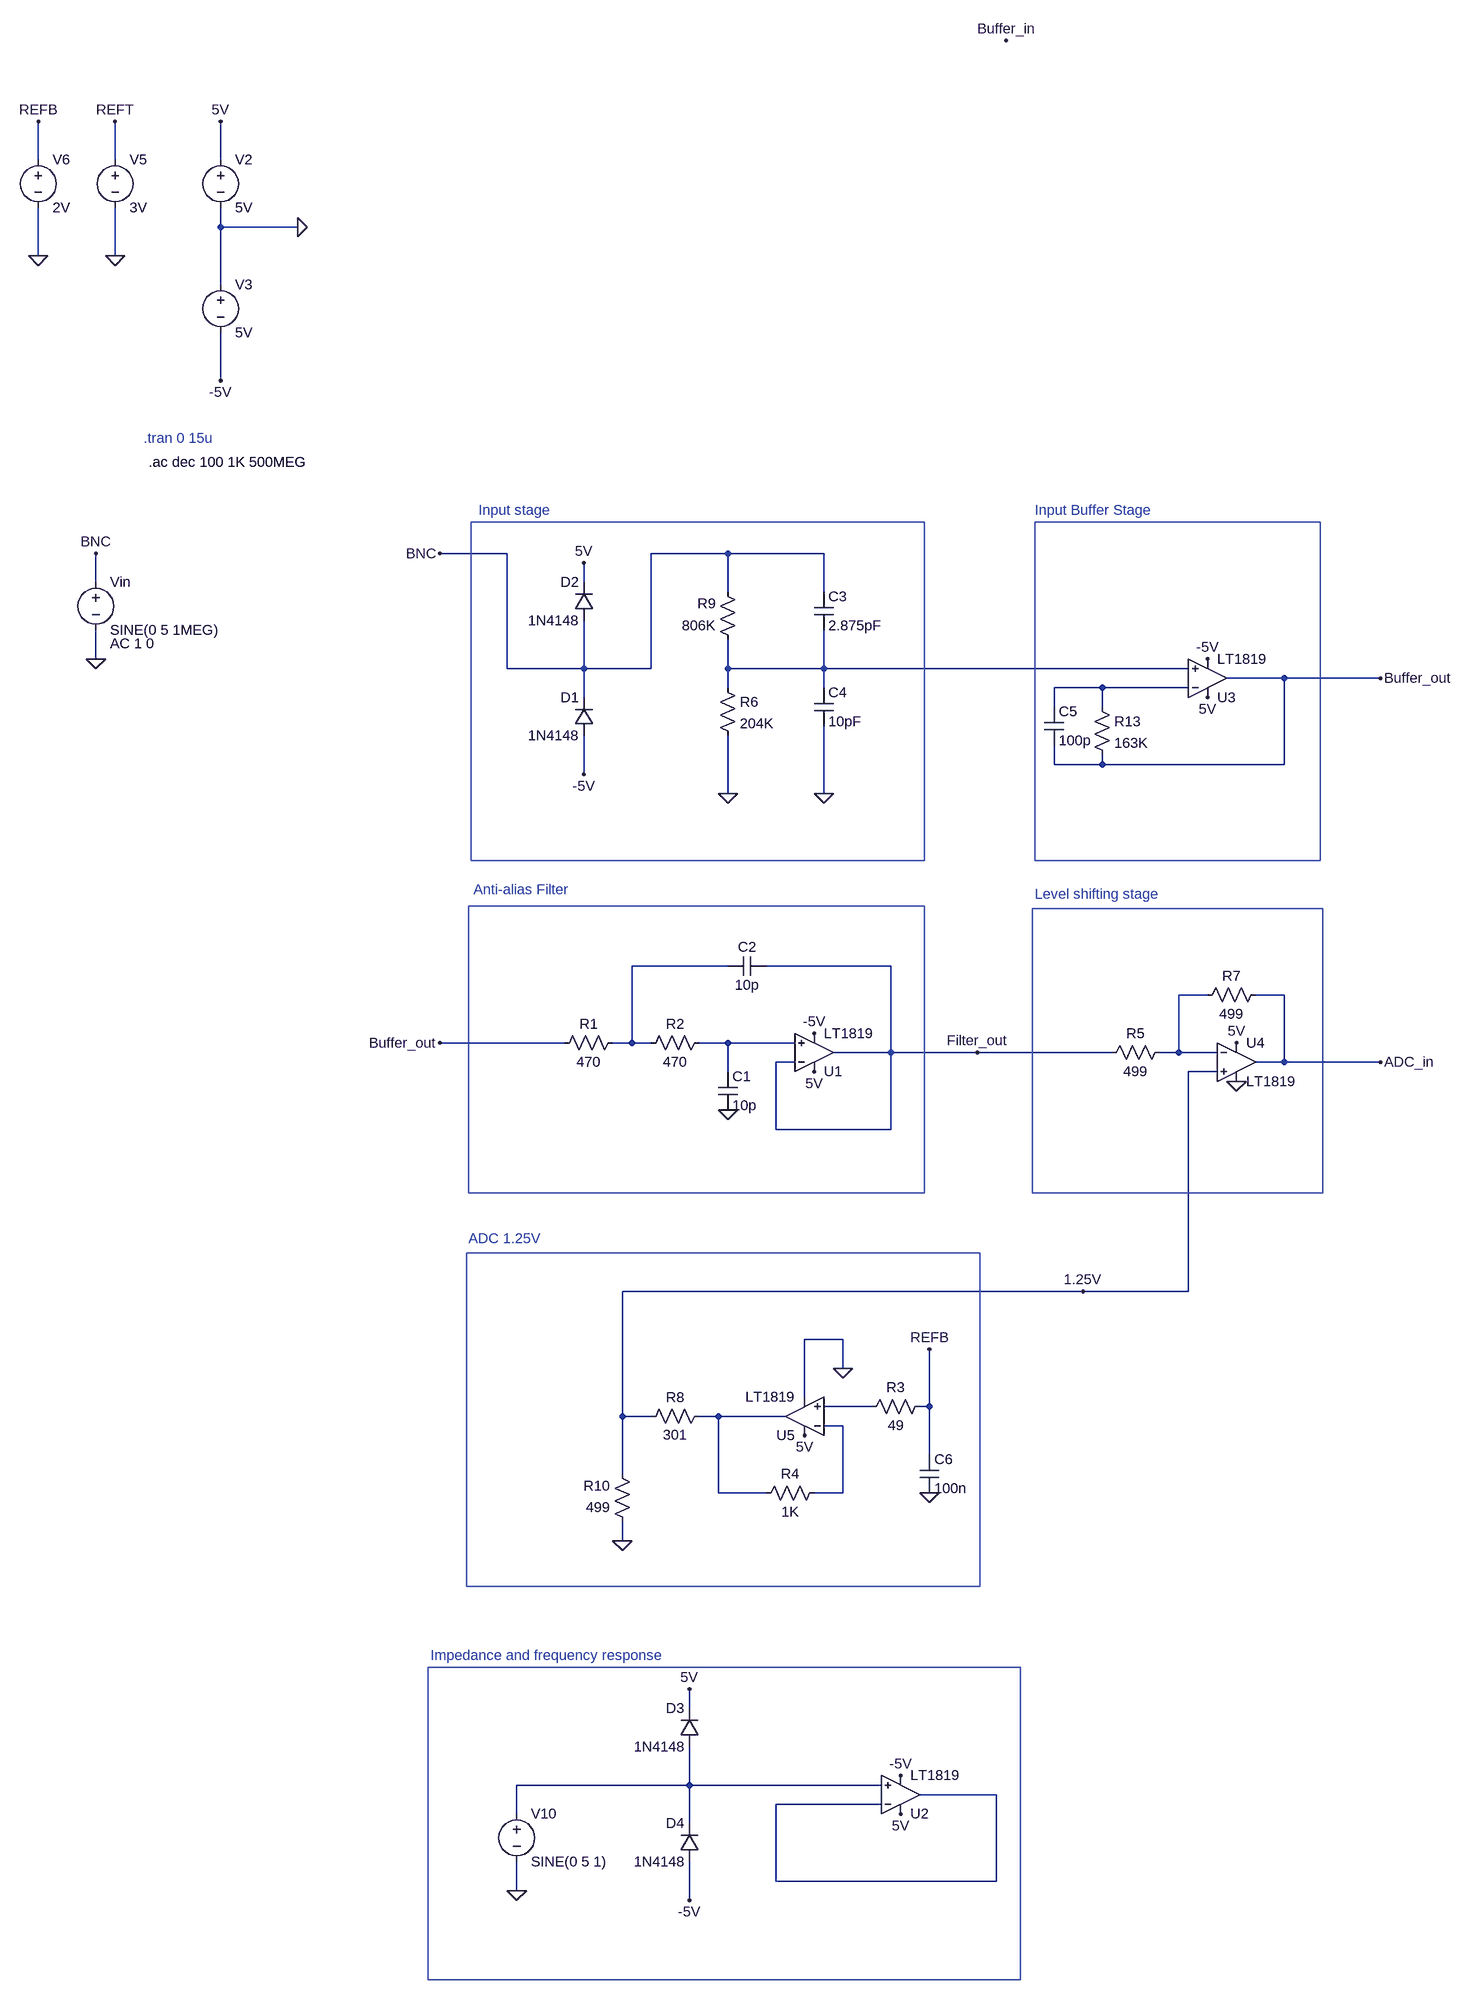
[diagram p0: schematic frontend.asc]
frontend.asc, the LTspice schematic file:
Version 4
SHEET 1 1620 3684
WIRE -2928 -64 -2928 -128
WIRE -2800 -64 -2800 -128
WIRE -2624 -64 -2624 -128
WIRE -2624 48 -2624 16
WIRE -2496 48 -2624 48
WIRE -2928 96 -2928 16
WIRE -2800 96 -2800 16
WIRE -2624 144 -2624 48
WIRE -2624 304 -2624 224
WIRE -2128 592 -2240 592
WIRE -1760 592 -1888 592
WIRE -1600 592 -1760 592
WIRE -2832 640 -2832 592
WIRE -2000 640 -2000 608
WIRE -1760 656 -1760 592
WIRE -1600 656 -1600 592
WIRE -2832 768 -2832 720
WIRE -2128 784 -2128 592
WIRE -2000 784 -2000 704
WIRE -2000 784 -2128 784
WIRE -1888 784 -1888 592
WIRE -1888 784 -2000 784
WIRE -1760 784 -1760 736
WIRE -1600 784 -1600 720
WIRE -1600 784 -1760 784
WIRE -992 784 -1600 784
WIRE -832 800 -928 800
WIRE -672 800 -832 800
WIRE -1760 816 -1760 784
WIRE -1600 816 -1600 784
WIRE -1136 816 -1216 816
WIRE -992 816 -1136 816
WIRE -2000 832 -2000 784
WIRE -1216 848 -1216 816
WIRE -1136 848 -1136 816
WIRE -1216 944 -1216 912
WIRE -1136 944 -1136 928
WIRE -1136 944 -1216 944
WIRE -832 944 -832 800
WIRE -832 944 -1136 944
WIRE -2000 960 -2000 896
WIRE -1760 992 -1760 896
WIRE -1600 992 -1600 880
WIRE -1760 1280 -1920 1280
WIRE -1488 1280 -1696 1280
WIRE -960 1328 -1008 1328
WIRE -832 1328 -880 1328
WIRE -2032 1408 -2240 1408
WIRE -1920 1408 -1920 1280
WIRE -1920 1408 -1952 1408
WIRE -1888 1408 -1920 1408
WIRE -1760 1408 -1808 1408
WIRE -1648 1408 -1760 1408
WIRE -1488 1424 -1488 1280
WIRE -1488 1424 -1584 1424
WIRE -1344 1424 -1488 1424
WIRE -1120 1424 -1344 1424
WIRE -1008 1424 -1008 1328
WIRE -1008 1424 -1040 1424
WIRE -944 1424 -1008 1424
WIRE -1648 1440 -1680 1440
WIRE -832 1440 -832 1328
WIRE -832 1440 -880 1440
WIRE -672 1440 -832 1440
WIRE -1760 1456 -1760 1408
WIRE -944 1456 -992 1456
WIRE -1680 1552 -1680 1440
WIRE -1488 1552 -1488 1424
WIRE -1488 1552 -1680 1552
WIRE -1168 1904 -1936 1904
WIRE -992 1904 -992 1456
WIRE -992 1904 -1168 1904
WIRE -1568 1984 -1632 1984
WIRE -1568 2032 -1568 1984
WIRE -1632 2080 -1632 1984
WIRE -1520 2096 -1600 2096
WIRE -1424 2096 -1424 2000
WIRE -1424 2096 -1440 2096
WIRE -1936 2112 -1936 1904
WIRE -1888 2112 -1936 2112
WIRE -1776 2112 -1808 2112
WIRE -1664 2112 -1776 2112
WIRE -1568 2128 -1600 2128
WIRE -1424 2176 -1424 2096
WIRE -1936 2208 -1936 2112
WIRE -1776 2240 -1776 2112
WIRE -1696 2240 -1776 2240
WIRE -1568 2240 -1568 2128
WIRE -1568 2240 -1616 2240
WIRE -1936 2320 -1936 2288
WIRE -1824 3184 -1824 3152
WIRE -1824 3312 -1824 3248
WIRE -1824 3312 -2112 3312
WIRE -1504 3312 -1824 3312
WIRE -1312 3328 -1440 3328
WIRE -1504 3344 -1680 3344
WIRE -2112 3360 -2112 3312
WIRE -1824 3376 -1824 3312
WIRE -1680 3472 -1680 3344
WIRE -1312 3472 -1312 3328
WIRE -1312 3472 -1680 3472
WIRE -2112 3488 -2112 3440
WIRE -1824 3504 -1824 3440
FLAG -2496 48 0
FLAG -2624 -128 5V
FLAG -2624 304 -5V
FLAG -2800 96 0
FLAG -2928 96 0
FLAG -2928 -128 REFB
FLAG -2800 -128 REFT
FLAG -1616 1392 -5V
FLAG -1616 1456 5V
FLAG -1760 1520 0
FLAG -960 832 5V
FLAG -960 768 -5V
FLAG -1760 992 0
FLAG -1600 992 0
FLAG -2832 768 0
FLAG -2000 608 5V
FLAG -2000 960 -5V
FLAG -912 1408 5V
FLAG -912 1472 0
FLAG -1472 3296 -5V
FLAG -2112 3488 0
FLAG -1472 3360 5V
FLAG -1824 3152 5V
FLAG -1824 3504 -5V
FLAG -1424 2240 0
FLAG -1936 2320 0
FLAG -1632 2144 5V
FLAG -672 800 Buffer_out
FLAG -2240 1408 Buffer_out
FLAG -2832 592 BNC
FLAG -1424 2000 REFB
FLAG -1296 -320 Buffer_in
FLAG -1344 1424 Filter_out
FLAG -1168 1904 1.25V
FLAG -2240 592 BNC
FLAG -672 1440 ADC_in
FLAG -1568 2032 0
SYMBOL voltage -2624 -80 R0
SYMATTR InstName V2
SYMATTR Value 5V
SYMBOL voltage -2624 128 R0
SYMATTR InstName V3
SYMATTR Value 5V
SYMBOL voltage -2800 -80 R0
SYMATTR InstName V5
SYMATTR Value 3V
SYMBOL voltage -2928 -80 R0
SYMATTR InstName V6
SYMATTR Value 2V
SYMBOL res -1936 1392 R90
WINDOW 0 0 56 VBottom 2
WINDOW 3 32 56 VTop 2
SYMATTR InstName R1
SYMATTR Value 470
SYMBOL res -1792 1392 R90
WINDOW 0 0 56 VBottom 2
WINDOW 3 32 56 VTop 2
SYMATTR InstName R2
SYMATTR Value 470
SYMBOL cap -1776 1456 R0
SYMATTR InstName C1
SYMATTR Value 10p
SYMBOL Opamps/LT1819 -1616 1424 M180
SYMATTR InstName U1
SYMBOL cap -1696 1264 R90
WINDOW 0 0 32 VBottom 2
WINDOW 3 32 32 VTop 2
SYMATTR InstName C2
SYMATTR Value 10p
SYMBOL diode -1984 704 R180
WINDOW 0 24 64 Left 2
WINDOW 3 24 0 Left 2
SYMATTR InstName D2
SYMATTR Value 1N4148
SYMBOL diode -1984 896 R180
WINDOW 0 24 64 Left 2
WINDOW 3 24 0 Left 2
SYMATTR InstName D1
SYMATTR Value 1N4148
SYMBOL res -1744 752 R180
WINDOW 0 36 76 Left 2
WINDOW 3 36 40 Left 2
SYMATTR InstName R9
SYMATTR Value 806K
SYMBOL Opamps/LT1819 -960 800 M180
SYMATTR InstName U3
SYMBOL res -1776 800 R0
SYMATTR InstName R6
SYMATTR Value 204K
SYMBOL cap -1616 656 R0
SYMATTR InstName C3
SYMATTR Value 2.875pF
SYMBOL cap -1616 816 R0
SYMATTR InstName C4
SYMATTR Value 10pF
SYMBOL voltage -2832 624 R0
WINDOW 123 24 118 Left 2
SYMATTR Value2 AC 1 0
SYMATTR InstName Vin
SYMATTR Value SINE(0 5 1MEG)
SYMBOL res -1024 1408 R90
WINDOW 0 0 56 VBottom 2
WINDOW 3 32 56 VTop 2
SYMATTR InstName R5
SYMATTR Value 499
SYMBOL res -864 1312 R90
WINDOW 0 0 56 VBottom 2
WINDOW 3 32 56 VTop 2
SYMATTR InstName R7
SYMATTR Value 499
SYMBOL Opamps/LT1819 -912 1440 R0
SYMATTR InstName U4
SYMBOL res -1152 832 R0
SYMATTR InstName R13
SYMATTR Value 163K
SYMBOL cap -1232 848 R0
SYMATTR InstName C5
SYMATTR Value 100p
SYMBOL Opamps/LT1819 -1472 3328 M180
SYMATTR InstName U2
SYMBOL voltage -2112 3344 R0
SYMATTR InstName V10
SYMATTR Value SINE(0 5 1)
SYMATTR Value2 AC 1 0
SYMBOL diode -1808 3248 R180
WINDOW 0 24 64 Left 2
WINDOW 3 24 0 Left 2
SYMATTR InstName D3
SYMATTR Value 1N4148
SYMBOL diode -1808 3440 R180
WINDOW 0 24 64 Left 2
WINDOW 3 24 0 Left 2
SYMATTR InstName D4
SYMATTR Value 1N4148
SYMBOL Opamps/LT1819 -1632 2112 R180
SYMATTR InstName U5
SYMBOL cap -1440 2176 R0
SYMATTR InstName C6
SYMATTR Value 100n
SYMBOL res -1600 2224 R90
WINDOW 0 0 56 VBottom 2
WINDOW 3 32 56 VTop 2
SYMATTR InstName R4
SYMATTR Value 1K
SYMBOL res -1792 2096 R90
WINDOW 0 0 56 VBottom 2
WINDOW 3 32 56 VTop 2
SYMATTR InstName R8
SYMATTR Value 301
SYMBOL res -1920 2304 R180
WINDOW 0 36 76 Left 2
WINDOW 3 36 40 Left 2
SYMATTR InstName R10
SYMATTR Value 499
SYMBOL res -1424 2080 R90
WINDOW 0 0 56 VBottom 2
WINDOW 3 32 56 VTop 2
SYMATTR InstName R3
SYMATTR Value 49
TEXT -2752 400 Left 2 ;.tran 0 15u
TEXT -2184 1152 Left 2 ;Anti-alias Filter
TEXT -1248 520 Left 2 ;Input Buffer Stage
TEXT -2176 520 Left 2 ;Input stage
TEXT -2744 440 Left 2 !.ac dec 100 1K 500MEG
TEXT -1248 1160 Left 2 ;Level shifting stage
TEXT -2256 3096 Left 2 ;Impedance and frequency response
TEXT -2192 1816 Left 2 ;ADC 1.25V
RECTANGLE Normal -2260 3116 -1272 3680
RECTANGLE Normal -2196 1840 -1340 2396
RECTANGLE Normal -1252 1184 -768 1740
RECTANGLE Normal -1248 540 -772 1104
RECTANGLE Normal -2192 1180 -1432 1740
RECTANGLE Normal -2188 540 -1432 1104

The netlist it stands for:
* frontend.asc
V2 5V 0 5V
V3 0 -5V 5V
V5 REFT 0 3V
V6 REFB 0 2V
R1 N003 Buffer_out 470
R2 N005 N003 470
C1 N005 0 10p
* U1: LT1819 (symbol Opamps/LT1819 not available, pins judged from their places): In+=N005 In-=Filter_out V+=5V V-=-5V OUT=Filter_out
C2 Filter_out N003 10p
D2 BNC 5V 1N4148
D1 -5V BNC 1N4148
R9 N001 BNC 806K
* U3: LT1819 (symbol Opamps/LT1819 not available, pins judged from their places): In+=N001 In-=N002 V+=5V V-=-5V OUT=Buffer_out
R6 N001 0 204K
C3 BNC N001 2.875pF
C4 N001 0 10pF
Vin BNC 0 SINE(0 5 1MEG) AC 1 0
R5 N004 Filter_out 499
R7 ADC_in N004 499
* U4: LT1819 (symbol Opamps/LT1819 not available, pins judged from their places): In+=1.25V In-=N004 V+=5V V-=0 OUT=ADC_in
R13 N002 Buffer_out 163K
C5 N002 Buffer_out 100p
* U2: LT1819 (symbol Opamps/LT1819 not available, pins judged from their places): In+=N009 In-=N010 V+=5V V-=-5V OUT=N010
V10 N009 0 SINE(0 5 1) AC 1 0
D3 N009 5V 1N4148
D4 -5V N009 1N4148
* U5: LT1819 (symbol Opamps/LT1819 not available, pins judged from their places): In+=N006 In-=N008 V+=5V V-=0 OUT=N007
C6 REFB 0 100n
R4 N008 N007 1K
R8 N007 1.25V 301
R10 0 1.25V 499
R3 REFB N006 49
.model D D
.lib standard.dio
* .tran 0 15u
* Anti-alias Filter
* Input Buffer Stage
* Input stage
.ac dec 100 1K 500MEG
* Level shifting stage
* Impedance and frequency response
* ADC 1.25V
.backanno
.end